# Altium schematic sheet ESP32-with-USB.SchDoc
size A2; SheetNumber: 1; SheetTotal: 1
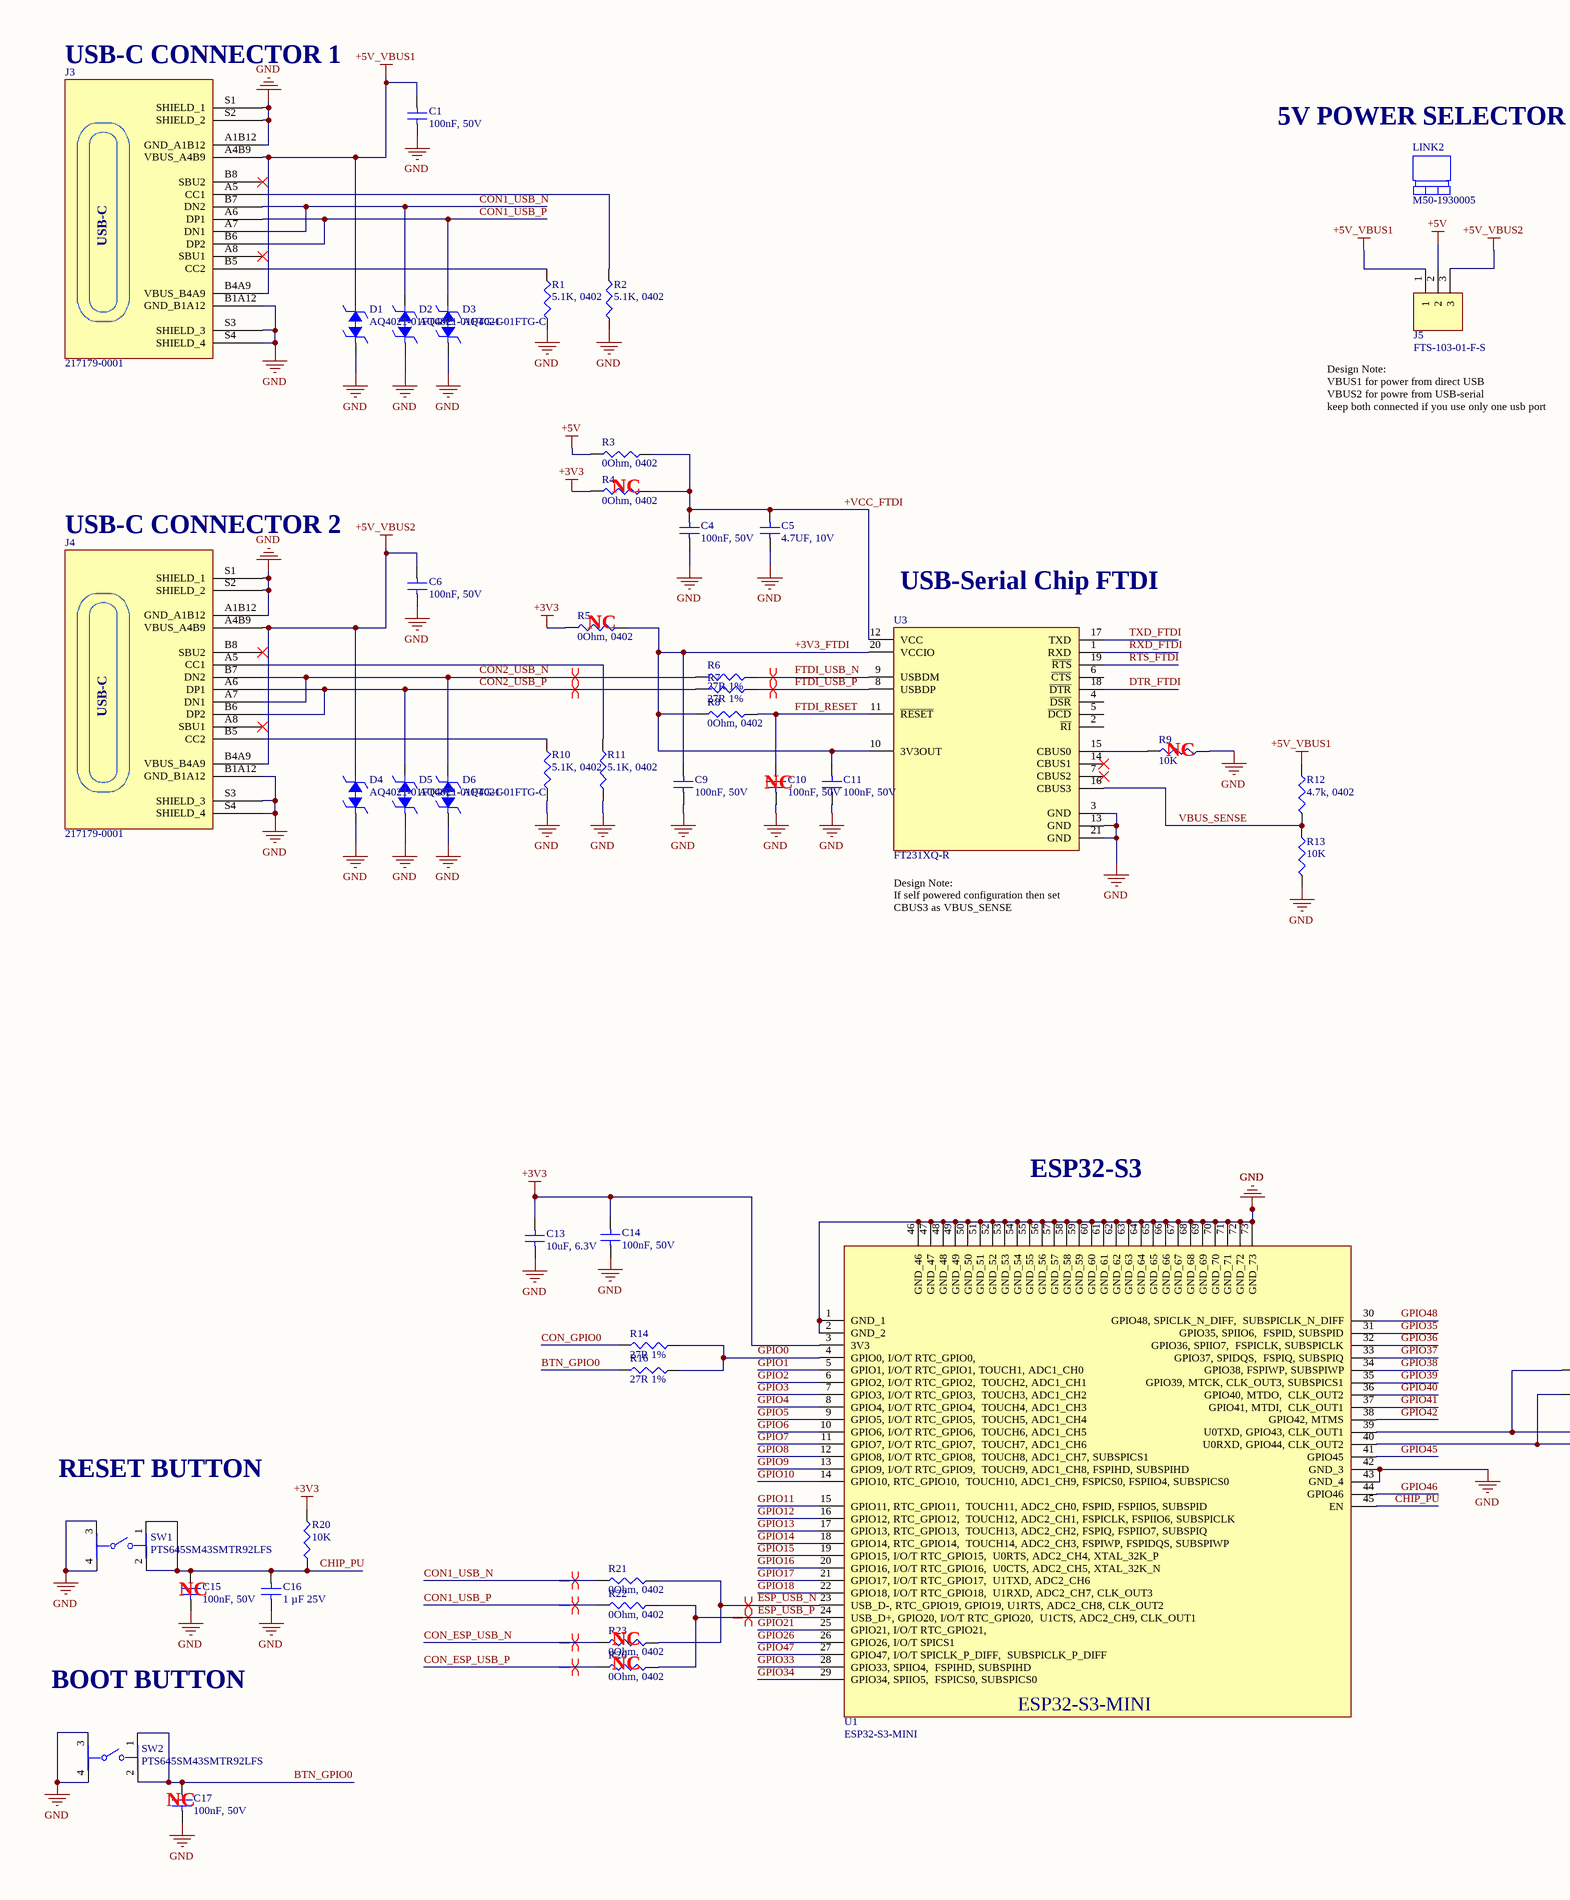
[diagram p0: ESP32-with-USB.SchDoc, left]
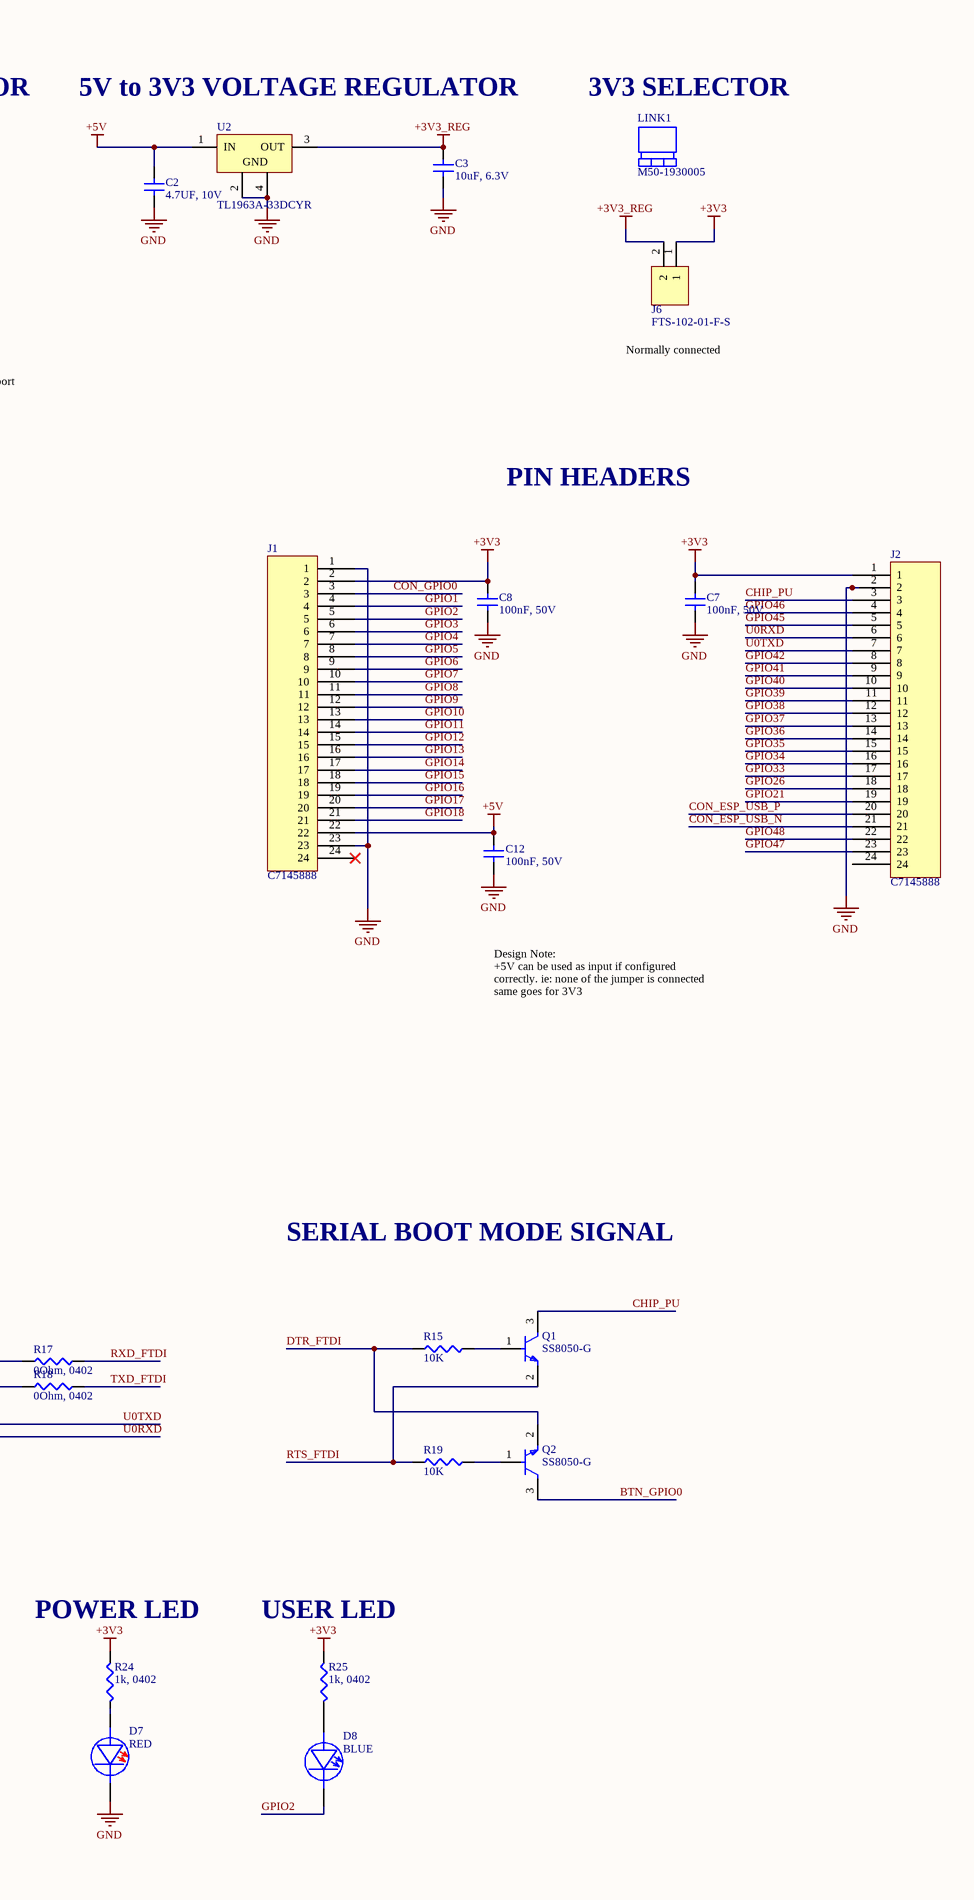
[diagram p1: ESP32-with-USB.SchDoc, right]

## Parts
C1  100nF, 50V  [CAPC1005X55N]
C2  4.7UF, 10V  [CAPC1005X55N]
C3  10uF, 6.3V  [CAPC1005X55N]
C4  100nF, 50V  [CAPC1005X55N]
C5  4.7UF, 10V  [CAPC1005X55N]
C6  100nF, 50V  [CAPC1005X55N]
C7  100nF, 50V  [CAPC1005X55N]
C8  100nF, 50V  [CAPC1005X55N]
C9  100nF, 50V  [CAPC1005X55N]
C10  100nF, 50V  [CAPC1005X55N]
C11  100nF, 50V  [CAPC1005X55N]
C12  100nF, 50V  [CAPC1005X55N]
C13  10uF, 6.3V  [CAPC1005X55N]
C14  100nF, 50V  [CAPC1005X55N]
C15  100nF, 50V  [CAPC1005X55N]
C16  1 µF 25V  [CAPC1005X55N]
C17  100nF, 50V  [CAPC1005X55N]
D1  AQ4021-01FTG-C  [AQ4021-01FTG-C_0805]
D2  AQ4021-01FTG-C  [AQ4021-01FTG-C_0805]
D3  AQ4021-01FTG-C  [AQ4021-01FTG-C_0805]
D4  AQ4021-01FTG-C  [AQ4021-01FTG-C_0805]
D5  AQ4021-01FTG-C  [AQ4021-01FTG-C_0805]
D6  AQ4021-01FTG-C  [AQ4021-01FTG-C_0805]
D7  RED  [LED_RED_0402]
D8  BLUE  [LED_BLUE_0402]
J1  C7145888  [HDR_1X24_2.54MM]
J2  C7145888  [HDR_1X24_2.54MM]
J3  217179-0001  [FP-2171790001-MFG]
J4  217179-0001  [FP-2171790001-MFG]
J5  FTS-103-01-F-S  [HDR_1X3_1.27MM]
J6  FTS-102-01-F-S  [HDR_1X2_1.27MM]
LINK1  M50-1930005  (mechanical)
LINK2  M50-1930005  (mechanical)
Q1  SS8050-G  [FP-SS8050-G-IPC_B]
Q2  SS8050-G  [FP-SS8050-G-IPC_B]
R1  5.1K, 0402  [RESC1005X37N]
R2  5.1K, 0402  [RESC1005X37N]
R3  0Ohm, 0402  [RESC1005X37N]
R4  0Ohm, 0402  [RESC1005X37N]
R5  0Ohm, 0402  [RESC1005X37N]
R6  27R 1%  [RESC1005X37N]
R7  27R 1%  [RESC1005X37N]
R8  0Ohm, 0402  [RESC1005X37N]
R9  10K  [RESC1005X37N]
R10  5.1K, 0402  [RESC1005X37N]
R11  5.1K, 0402  [RESC1005X37N]
R12  4.7k, 0402  [RESC1005X37N]
R13  10K  [RESC1005X37N]
R14  27R 1%  [RESC1005X37N]
R15  10K  [RESC1005X37N]
R16  27R 1%  [RESC1005X37N]
R17  0Ohm, 0402  [RESC1005X37N]
R18  0Ohm, 0402  [RESC1005X37N]
R19  10K  [RESC1005X37N]
R20  10K  [RESC1005X37N]
R21  0Ohm, 0402  [RESC1005X37N]
R22  0Ohm, 0402  [RESC1005X37N]
R23  0Ohm, 0402  [RESC1005X37N]
R24  1k, 0402  [RESC1005X37N]
R25  1k, 0402  [RESC1005X37N]
R26  0Ohm, 0402  [RESC1005X37N]
SW1  PTS645SM43SMTR92LFS  [FP-PTS645SM43SMTR92LFS-MFG]
SW2  PTS645SM43SMTR92LFS  [FP-PTS645SM43SMTR92LFS-MFG]
U1  ESP32-S3-MINI  [XCVR_ESP32-S3-MINI-1-N8]
U2  TL1963A-33DCYR  [DCY0004A_N]
U3  FT231XQ-R  [FP-QFN-20-IPC_B]

## Nets
+3V3: C7.2 C8.2 C13.2 C14.2 J1.2 J2.1 J6.1 R4.1 R5.1 R20.2 R24.1 R25.1 U1.3(3V3)
+3V3_REG: C3.2 J6.2 U2.3(OUT)
+5V: C2.2 C12.2 J1.22 J5.2 R3.1 U2.1(IN)
+5V_VBUS1: C1.2 D1.2 J3.A4B9(VBUS_A4B9) J3.B4A9(VBUS_B4A9) J5.1 R12.2
+5V_VBUS2: C6.2 D4.2 J4.A4B9(VBUS_A4B9) J4.B4A9(VBUS_B4A9) J5.3
GND: C1.1 C2.1 C3.1 C4.1 C5.1 C6.1 C7.1 C8.1 C9.1 C10.1 C11.1 C12.1 C13.1 C14.1 C15.1 C16.1 C17.1 D1.1 D2.1 D3.1 D4.1 D5.1 D6.1 D7.K- J1.1 J1.23 J2.2 J3.A1B12(GND_A1B12) J3.B1A12(GND_B1A12) J3.S1(SHIELD_1) J3.S2(SHIELD_2) J3.S3(SHIELD_3) J3.S4(SHIELD_4) J4.A1B12(GND_A1B12) J4.B1A12(GND_B1A12) J4.S1(SHIELD_1) J4.S2(SHIELD_2) J4.S3(SHIELD_3) J4.S4(SHIELD_4) R1.2 R2.2 R9.2 R10.2 R11.2 R13.1 SW1.3 SW1.4 SW2.3 SW2.4 U1.1(GND_1) U1.2(GND_2) U1.42(GND_3) U1.43(GND_4) U1.46(GND_46) U1.47(GND_47) U1.48(GND_48) U1.49(GND_49) U1.50(GND_50) U1.51(GND_51) U1.52(GND_52) U1.53(GND_53) U1.54(GND_54) U1.55(GND_55) U1.56(GND_56) U1.57(GND_57) U1.58(GND_58) U1.59(GND_59) U1.60(GND_60) U1.61(GND_61) U1.62(GND_62) U1.63(GND_63) U1.64(GND_64) U1.65(GND_65) U1.66(GND_66) U1.67(GND_67) U1.68(GND_68) U1.69(GND_69) U1.70(GND_70) U1.71(GND_71) U1.72(GND_72) U1.73(GND_73) U2.2(GND) U2.4(GND) U3.3(GND) U3.13(GND) U3.21(GND)
+3V3_FTDI: C9.2 C11.2 R5.2 R8.1 U3.10(3V3OUT) U3.20(VCCIO)
+VCC_FTDI: C4.2 C5.2 R3.2 R4.2 U3.12(VCC)
BTN_GPIO0: C17.2 Q2.3(C) R16.1 SW2.1 SW2.2
CHIP_PU: C15.2 C16.2 J2.3 Q1.3(C) R20.1 SW1.1 SW1.2 U1.45(EN)
CON1_USB_N: D2.2 J3.A7(DN1) J3.B7(DN2) R21.1
CON1_USB_P: D3.2 J3.A6(DP1) J3.B6(DP2) R22.1
CON2_USB_N: D6.2 J4.A7(DN1) J4.B7(DN2) R6.1
CON2_USB_P: D5.2 J4.A6(DP1) J4.B6(DP2) R7.1
CON_ESP_USB_N: J2.21 R23.1
CON_ESP_USB_P: J2.20 R26.1
CON_GPIO0: J1.3 R14.1
DTR_FTDI: Q2.2(E) R15.1 U3.18(~{DTR})
ESP_USB_N: R21.2 R23.2 U1.23(USB_D-,_RTC_GPIO19,_GPIO19,_U1RTS,_ADC2_CH8,_CLK_OUT2)
ESP_USB_P: R22.2 R26.2 U1.24(USB_D+,_GPIO20,_I/O/T_RTC_GPIO20,__U1CTS,_ADC2_CH9,_CLK_OUT1)
FTDI_RESET: C10.2 R8.2 U3.11(~{RESET})
FTDI_USB_N: R6.2 U3.9(USBDM)
FTDI_USB_P: R7.2 U3.8(USBDP)
GPIO0: R14.2 R16.2 U1.4(GPIO0,_I/O/T_RTC_GPIO0,)
GPIO1: J1.4 U1.5(GPIO1,_I/O/T_RTC_GPIO1,_TOUCH1,_ADC1_CH0)
GPIO2: D8.K- J1.5 U1.6(GPIO2,_I/O/T_RTC_GPIO2,__TOUCH2,_ADC1_CH1)
GPIO3: J1.6 U1.7(GPIO3,_I/O/T_RTC_GPIO3,__TOUCH3,_ADC1_CH2)
GPIO4: J1.7 U1.8(GPIO4,_I/O/T_RTC_GPIO4,__TOUCH4,_ADC1_CH3)
GPIO5: J1.8 U1.9(GPIO5,_I/O/T_RTC_GPIO5,__TOUCH5,_ADC1_CH4)
GPIO6: J1.9 U1.10(GPIO6,_I/O/T_RTC_GPIO6,__TOUCH6,_ADC1_CH5)
GPIO7: J1.10 U1.11(GPIO7,_I/O/T_RTC_GPIO7,__TOUCH7,_ADC1_CH6)
GPIO8: J1.11 U1.12(GPIO8,_I/O/T_RTC_GPIO8,__TOUCH8,_ADC1_CH7,_SUBSPICS1)
GPIO9: J1.12 U1.13(GPIO9,_I/O/T_RTC_GPIO9,__TOUCH9,_ADC1_CH8,_FSPIHD,_SUBSPIHD)
GPIO10: J1.13 U1.14(GPIO10,_RTC_GPIO10,__TOUCH10,_ADC1_CH9,_FSPICS0,_FSPIIO4,_SUBSPICS0)
GPIO11: J1.14 U1.15(GPIO11,_RTC_GPIO11,__TOUCH11,_ADC2_CH0,_FSPID,_FSPIIO5,_SUBSPID)
GPIO12: J1.15 U1.16(GPIO12,_RTC_GPIO12,__TOUCH12,_ADC2_CH1,_FSPICLK,_FSPIIO6,_SUBSPICLK)
GPIO13: J1.16 U1.17(GPIO13,_RTC_GPIO13,__TOUCH13,_ADC2_CH2,_FSPIQ,_FSPIIO7,_SUBSPIQ)
GPIO14: J1.17 U1.18(GPIO14,_RTC_GPIO14,__TOUCH14,_ADC2_CH3,_FSPIWP,_FSPIDQS,_SUBSPIWP)
GPIO15: J1.18 U1.19(GPIO15,_I/O/T_RTC_GPIO15,__U0RTS,_ADC2_CH4,_XTAL_32K_P)
GPIO16: J1.19 U1.20(GPIO16,_I/O/T_RTC_GPIO16,__U0CTS,_ADC2_CH5,_XTAL_32K_N)
GPIO17: J1.20 U1.21(GPIO17,_I/O/T_RTC_GPIO17,__U1TXD,_ADC2_CH6)
GPIO18: J1.21 U1.22(GPIO18,_I/O/T_RTC_GPIO18,__U1RXD,_ADC2_CH7,_CLK_OUT3)
GPIO21: J2.19 U1.25(GPIO21,_I/O/T_RTC_GPIO21,)
GPIO26: J2.18 U1.26(GPIO26,_I/O/T_SPICS1)
GPIO33: J2.17 U1.28(GPIO33,_SPIIO4,__FSPIHD,_SUBSPIHD)
GPIO34: J2.16 U1.29(GPIO34,_SPIIO5,__FSPICS0,_SUBSPICS0)
GPIO35: J2.15 U1.31(GPIO35,_SPIIO6,__FSPID,_SUBSPID)
GPIO36: J2.14 U1.32(GPIO36,_SPIIO7,__FSPICLK,_SUBSPICLK)
GPIO37: J2.13 U1.33(GPIO37,_SPIDQS,__FSPIQ,_SUBSPIQ)
GPIO38: J2.12 U1.34(GPIO38,_FSPIWP,_SUBSPIWP)
GPIO39: J2.11 U1.35(GPIO39,_MTCK,_CLK_OUT3,_SUBSPICS1)
GPIO40: J2.10 U1.36(GPIO40,_MTDO,__CLK_OUT2)
GPIO41: J2.9 U1.37(GPIO41,_MTDI,__CLK_OUT1)
GPIO42: J2.8 U1.38(GPIO42,_MTMS)
GPIO45: J2.5 U1.41(GPIO45)
GPIO46: J2.4 U1.44(GPIO46)
GPIO47: J2.23 U1.27(GPIO47,_I/O/T_SPICLK_P_DIFF,__SUBSPICLK_P_DIFF)
GPIO48: J2.22 U1.30(GPIO48,_SPICLK_N_DIFF,__SUBSPICLK_N_DIFF)
RTS_FTDI: Q1.2(E) R19.1 U3.19(~{RTS})
RXD_FTDI: R17.2 U3.1(RXD)
TXD_FTDI: R18.2 U3.17(TXD)
U0RXD: J2.6 R18.1 U1.40(U0RXD,_GPIO44,_CLK_OUT2)
U0TXD: J2.7 R17.1 U1.39(U0TXD,_GPIO43,_CLK_OUT1)
VBUS_SENSE: R12.1 R13.2 U3.16(CBUS3)
NetD7_A+: D7.A+ R24.2
NetD8_A+: D8.A+ R25.2
NetJ3_A5: J3.A5(CC1) R2.1
NetJ3_B5: J3.B5(CC2) R1.1
NetJ4_A5: J4.A5(CC1) R11.1
NetJ4_B5: J4.B5(CC2) R10.1
NetQ1_1: Q1.1(B) R15.2
NetQ2_1: Q2.1(B) R19.2
NetR9_1: R9.1 U3.15(CBUS0)

Not connected (* = marked no-connect by the designer): J1 24*; J2 24; J3 A8(SBU1)* B8(SBU2)*; J4 A8(SBU1)* B8(SBU2)*; U3 2(~{RI}) 4(~{DSR}) 5(~{DCD}) 6(~{CTS}) 7(CBUS2)* 14(CBUS1)*

## Layout directives
differential pair; differential pair class DIFF90: CON1_USB_N, CON1_USB_P, CON2_USB_N, CON2_USB_P, CON_ESP_USB_N, CON_ESP_USB_P, ESP_USB_N, ESP_USB_P, FTDI_USB_N, FTDI_USB_P

## Notes on the sheet
- (near J3) USB-C CONNECTOR 1
- 5V POWER SELECTOR
- 5V to 3V3 VOLTAGE REGULATOR
- 3V3 SELECTOR
- Design Note:
  VBUS1 for power from direct USB
  VBUS2 for powre from USB-serial
  keep both connected if you use only one usb port
- Normally connected
- (near J4) USB-C CONNECTOR 2
- (near R4) NC
- PIN HEADERS
- (near U3) USB-Serial Chip FTDI
- (near R5) NC
- (near R9) NC
- (near C10) NC
- (near U3) Design Note:
  If self powered configuration then set CBUS3 as VBUS_SENSE
- Design Note:
  +5V can be used as input if configured correctly. ie: none of the jumper is connected
  same goes for 3V3
- ESP32-S3
- SERIAL BOOT MODE SIGNAL
- RESET BUTTON
- (near C15) NC
- (near R23) NC
- (near R24) POWER LED
- (near R25) USER LED
- BOOT BUTTON
- (near R26) NC
- (near C17) NC
- (in symbol 217179-0001) USB-C

## Library data of the parts
C1 C4 C6-C12 C14 C15 C17 = CL05B104KB54PNC: 0.1 µF ±10% 50V Ceramic Capacitor X7R 0402 (1005 Metric); Manufacturer: Samsung; Material: 4241ConductorMaterial; Supplier: Arrow Electronics; Supplier Part Number: CL05B104KB54PNC; Manufacturer Part Number: CL05B104KB54PNC; RoHS: Yes; Category: Ceramic Capacitors; Stock: 2120000; Pricing: 10000=0.0057 (USD); Case/Package: 343Case; Min Operating Temperature: -55°C; Max Operating Temperature: 125°C; Tolerance: 10%; Voltage Rating: 50V; Value: 100nF; Height: 550um; RoHS Compliant: Yes; ComponentLink1URL: https://datasheet.octopart.com/CL05B104KB54PNC-Samsung-datasheet-8326407.pdf?src-supplier=TME; ComponentLink1Description: https://datasheet.octopart.com/CL05B104KB54PNC-Samsung-datasheet-8326407.pdf?src-supplier=TME; LCSC Part Number: C307331
C2 C5 = CL05A475MP5NRNC: CAP CER 4.7UF 10V X5R 0402; Manufacturer: Samsung; Dielectric Material: Ceramic; Multilayer: Yes; Tolerance  (fill in as +-): 20%; Supplier: Digikey; Supplier Part Number: 1276-1482-1-ND; Manufacturer Part Number: CL05A475MP5NRNC; RoHS: Yes; Category: Ceramic Capacitors; Stock: 2427092; Pricing: 1=0.1, 10=0.064, 50=0.0368, 100=0.0286, 500=0.0215, 1000=0.01689, 2500=0.01535, 5000=0.01412 (USD); Mounting Technology: Surface Mount; Pins: 2; Package Shape: Rectangular; Case/Package: 0402; Terminal Finish: Nickel; Min Operating Temperature: -55°C; Max Operating Temperature: 85°C; JESD-609 Code: e3; Value: 4.7uF; Capacitor Type: Ceramic; Package Style: SMTMeter; Packaging: Tape and Reel; Tolerance (fill in as +-): 20%; Rated DC Voltage (URdc): 10V; Temperature Characteristics Code: X5R; Termination: Wraparound; Length: 1mm; Width: 0.5mm; Height: 0.65mm; Reach SVHC Compliant: Yes; RoHS Compliant: Yes; ComponentLink1URL: https://datasheet.ciiva.com:443/pdfs/VipMasterIC/IC/SEMS/SEMS-S-A0009022611/SEMS-S-A0009022611-1.pdf?src-supplier=IHS+Markit; ComponentLink1Description: https://datasheet.ciiva.com:443/pdfs/VipMasterIC/IC/SEMS/SEMS-S-A0009022611/SEMS-S-A0009022611-1.pdf?src-supplier=IHS+Markit; ComponentLink2URL: https://datasheet.ciiva.com/25786/cl05a475mp5nrnc-25786963.pdf?src-supplier=Digikey; ComponentLink2Description: https://datasheet.ciiva.com/25786/cl05a475mp5nrnc-25786963.pdf?src-supplier=Digikey; ComponentLink3URL: https://datasheet.ciiva.com/16437/cl05b104kq5nnnc-16437353.pdf?src-supplier=Future+Electronics; ComponentLink3Description: https://datasheet.ciiva.com/16437/cl05b104kq5nnnc-16437353.pdf?src-supplier=Future+Electronics; LCSC Part Number: C23733
C3 C13 = GRM155R60J106ME05D: 10 µF ±20% 6.3V Ceramic Capacitor X5R 0402 (1005 Metric); Manufacturer: Murata; Material: 4241ConductorMaterial; Dielectric: 1537DielectricType; Supplier: Future Electronics; Supplier Part Number: 5135029; Manufacturer Part Number: GRM155R60J106ME05D; RoHS: Yes; Category: Ceramic Capacitors; Stock: 20000; Pricing: 10000=0.0104, 30000=0.0099, 50000=0.0097, 100000=0.0095, 200000=0.0091 (USD); Case/Package: 343Case; Min Operating Temperature: -55°C; Max Operating Temperature: 85°C; Value: 10uF; Tolerance: 20%; Voltage Rating: 6.3V; Voltage Rating (DC): 6.3V; Length: 1mm; Width: 500um; Height: 700um; Thickness: 500um; ComponentLink1URL: https://datasheet.octopart.com/GRM155R60J106ME05D-Murata-datasheet-155239051.pdf?src-supplier=Element14; ComponentLink1Description: https://datasheet.octopart.com/GRM155R60J106ME05D-Murata-datasheet-155239051.pdf?src-supplier=Element14; ComponentLink2URL: https://datasheet.octopart.com/GRM155R60J106ME05D-Murata-datasheet-165579666.pdf?src-supplier=TME; ComponentLink2Description: https://datasheet.octopart.com/GRM155R60J106ME05D-Murata-datasheet-165579666.pdf?src-supplier=TME; LCSC Part Number: C723895
C16 = CL05A105KA5NQNC: 1 µF ±10% 25V Ceramic Capacitor X5R 0402 (1005 Metric); Manufacturer: Samsung; Value: 1uF; Multilayer: Yes; Supplier: Digikey; Supplier Part Number: 1276-1445-1-ND; Manufacturer Part Number: CL05A105KA5NQNC; RoHS: Yes; Category: Ceramic Capacitors; Stock: 1937229; Pricing: 1=0.18, 10=0.124, 50=0.0742, 100=0.0584, 500=0.04312, 1000=0.0357, 2500=0.03323, 5000=0.0304 (USD); Mounting Technology: Surface Mount; Pins: 2; Case/Package: 0402; Terminal Finish: Nickel; Dielectric Material: Ceramic; Package Shape: Rectangular; Min Operating Temperature: -55°C; Max Operating Temperature: 85°C; JESD-609 Code: e3; Package Style: SMTMeter; Packaging: Tape and Reel; Termination: Wraparound; Capacitor Type: Ceramic; Tolerance  (fill in as +-): 10%; Tolerance (fill in as +-): 10%; Rated DC Voltage (URdc): 25V; Temperature Characteristics Code: X5R; Length: 1mm; Width: 0.5mm; Height: 0.6mm; Reach SVHC Compliant: Yes; RoHS Compliant: Yes; ComponentLink1URL: https://datasheet.ciiva.com:443/pdfs/VipMasterIC/IC/SEMS/SEMS-S-A0008384515/SEMS-S-A0008872946-1.pdf?src-supplier=IHS+Markit; ComponentLink1Description: https://datasheet.ciiva.com:443/pdfs/VipMasterIC/IC/SEMS/SEMS-S-A0008384515/SEMS-S-A0008872946-1.pdf?src-supplier=IHS+Markit; ComponentLink2URL: https://datasheet.ciiva.com/25720/cl05a105ka5nqnc-25720771.pdf?src-supplier=Digikey; ComponentLink2Description: https://datasheet.ciiva.com/25720/cl05a105ka5nqnc-25720771.pdf?src-supplier=Digikey; ComponentLink3URL: https://datasheet.ciiva.com/3777/cl05a105ka5nqnc-3777709.pdf?src-supplier=Arrow+Electronics; ComponentLink3Description: https://datasheet.ciiva.com/3777/cl05a105ka5nqnc-3777709.pdf?src-supplier=Arrow+Electronics; ComponentLink4URL: https://datasheet.ciiva.com/29198/459147-da-01-en-vs-kondensator-0402-29198339.pdf?src-supplier=Conrad; ComponentLink4Description: https://datasheet.ciiva.com/29198/459147-da-01-en-vs-kondensator-0402-29198339.pdf?src-supplier=Conrad; LCSC Part Number: C52923
D1-D6 = AQ4021-01FTG-C: Trans Voltage Suppressor Diode; Manufacturer: Littelfuse; Time @ Peak Reflow Temperature-Max (s): 40s; Supplier: Digikey; Supplier Part Number: F10397CT-ND; Manufacturer Part Number: AQ4021-01FTG-C; RoHS: Yes; Category: TVS Diodes; Stock: 6289; Pricing: 1=0.57, 10=0.498, 100=0.3447, 500=0.28802, 1000=0.24513 (USD); Terminal Finish: Tin; JESD-609 Code: e3; Diode Type: TRANS VOLTAGE SUPPRESSOR; Moisture Sensitivity Level: 1; Peak Reflow Temperature (Cel): 260°C; Reach SVHC Compliant: Yes; RoHS Compliant: Yes; ComponentLink1URL: https://datasheet.ciiva.com:443/pdfs/VipMasterIC/IC/LFSI/LFSI-S-A0009000937/LFSI-S-A0009000937-1.pdf?src-supplier=IHS+Markit; ComponentLink1Description: https://datasheet.ciiva.com:443/pdfs/VipMasterIC/IC/LFSI/LFSI-S-A0009000937/LFSI-S-A0009000937-1.pdf?src-supplier=IHS+Markit; ComponentLink2URL: http://www.farnell.com/datasheets/2571805.pdf?src-supplier=Farnell; ComponentLink2Description: http://www.farnell.com/datasheets/2571805.pdf?src-supplier=Farnell; ComponentLink3URL: http://www.farnell.com/datasheets/2571805.pdf?src-supplier=Newark; ComponentLink3Description: http://www.farnell.com/datasheets/2571805.pdf?src-supplier=Newark; ComponentLink4URL: http://www.littelfuse.com/~/media/electronics/datasheets/tvs_diode_arrays/littelfuse_tvs_diode_array_aq4021_datasheet.pdf.pdf?src-supplier=Digikey; ComponentLink4Description: http://www.littelfuse.com/~/media/electronics/datasheets/tvs_diode_arrays/littelfuse_tvs_diode_array_aq4021_datasheet.pdf.pdf?src-supplier=Digikey; ComponentLink5URL: https://www.littelfuse.com/~/media/electronics/datasheets/tvs_diode_arrays/littelfuse_tvs_diode_array_aq4021_datasheet.pdf.pdf?src-supplier=Digikey; ComponentLink5Description: https://www.littelfuse.com/~/media/electronics/datasheets/tvs_diode_arrays/littelfuse_tvs_diode_array_aq4021_datasheet.pdf.pdf?src-supplier=Digikey; LCSC Part Number: C708873
D7 = VLMS1500-GS08: LED RED 0402 SMD; Manufacturer: Vishay; Viewing Angle: 130°; Forward Current: 30mA; Forward Voltage: 2V; Luminous Intensity: 54mcd; Dominant Wavelength: 631nm; Test Current: 20mA; Lens Style: Flat,Rectangular,Square; Number of LEDs: 1; Power Rating: 75mW; Lens Size: 0.5mm; Supplier: Digikey; Supplier Part Number: VLMS1500-GS08CT-ND; Manufacturer Part Number: VLMS1500-GS08; RoHS: Yes; Category: LEDs; Stock: 52203; Pricing: 1=0.34, 10=0.265, 100=0.119, 500=0.10746, 1000=0.08827 (USD); Mounting Technology: Surface Mount; Case/Package: 0402; Pins: 2; Color: Red; Case Code (Metric): 1005; Case Code (Imperial): 0402; Min Operating Temperature: -30°C; Max Operating Temperature: 85°C; Package Quantity: 9000; Packaging: Tape and Reel; Illumination Color: Red; Wavelength: 631nm; Series: CHipLED; Length: 1mm; Width: 0.5mm; Height: 0.55mm; Radiation Hardening: No; Lead Free: Lead Free; RoHS Compliant: Yes; Reach SVHC Compliant: Unknown; ComponentLink1URL: http://components.arrow.com/part/dataview/56357384S461524N5680?src-supplier=Arrow+Electronics; ComponentLink1Description: http://components.arrow.com/part/dataview/56357384S461524N5680?src-supplier=Arrow+Electronics; ComponentLink2URL: http://www.mouser.com/ds/2/427/vlmo1500-244705.pdf?src-supplier=Mouser; ComponentLink2Description: http://www.mouser.com/ds/2/427/vlmo1500-244705.pdf?src-supplier=Mouser; ComponentLink3URL: http://www.farnell.com/datasheets/1809983.pdf?src-supplier=Farnell; ComponentLink3Description: http://www.farnell.com/datasheets/1809983.pdf?src-supplier=Farnell; ComponentLink4URL: http://www.alliedelec.com/m/d/cfc385e1097fc985ee9a50a3551ac188.pdf?src-supplier=Allied+Electronics; ComponentLink4Description: http://www.alliedelec.com/m/d/cfc385e1097fc985ee9a50a3551ac188.pdf?src-supplier=Allied+Electronics; ComponentLink5URL: https://datasheet.octopart.com/VLMS1500-GS08-Vishay-datasheet-62332426.pdf?src-supplier=Newark; ComponentLink5Description: https://datasheet.octopart.com/VLMS1500-GS08-Vishay-datasheet-62332426.pdf?src-supplier=Newark; ComponentLink6URL: http://www.vishay.com/docs/82554/vlmo1500.pdf?src-supplier=Avnet; ComponentLink6Description: http://www.vishay.com/docs/82554/vlmo1500.pdf?src-supplier=Avnet; ComponentLink7URL: https://datasheet.octopart.com/VLMS1500-GS08-Vishay-datasheet-21227148.pdf?src-supplier=Future+Electronics; ComponentLink7Description: https://datasheet.octopart.com/VLMS1500-GS08-Vishay-datasheet-21227148.pdf?src-supplier=Future+Electronics; ComponentLink8URL: http://www.farnell.com/datasheets/2050839.pdf?src-supplier=Newark; ComponentLink8Description: http://www.farnell.com/datasheets/2050839.pdf?src-supplier=Newark; ComponentLink9URL: http://www.farnell.com/datasheets/1809983.pdf?src-supplier=Element14; ComponentLink9Description: http://www.farnell.com/datasheets/1809983.pdf?src-supplier=Element14; ComponentLink10URL: https://datasheet.octopart.com/VLMS1500-GS08-Vishay-datasheet-33014519.pdf?src-supplier=Element14; ComponentLink10Description: https://datasheet.octopart.com/VLMS1500-GS08-Vishay-datasheet-33014519.pdf?src-supplier=Element14; ComponentLink11URL: http://www.farnell.com/datasheets/1809983.pdf?src-supplier=Newark; ComponentLink11Description: http://www.farnell.com/datasheets/1809983.pdf?src-supplier=Newark; ComponentLink12URL: http://datasheet.octopart.com/VLMS1500-GS08-Vishay-datasheet-21227148.pdf?src-supplier=Avnet; ComponentLink12Description: http://datasheet.octopart.com/VLMS1500-GS08-Vishay-datasheet-21227148.pdf?src-supplier=Avnet; ComponentLink13URL: http://datasheet.octopart.com/VLMS1500-GS08-Vishay-datasheet-21227148.pdf?src-supplier=LCSC; ComponentLink13Description: http://datasheet.octopart.com/VLMS1500-GS08-Vishay-datasheet-21227148.pdf?src-supplier=LCSC; ComponentLink14URL: http://datasheet.octopart.com/VLMS1500-GS08-Vishay-datasheet-21227148.pdf?src-supplier=Quest; ComponentLink14Description: http://datasheet.octopart.com/VLMS1500-GS08-Vishay-datasheet-21227148.pdf?src-supplier=Quest; ComponentLink15URL: http://datasheet.octopart.com/VLMS1500-GS08-Vishay-datasheet-21227148.pdf?src-supplier=NAC+Semi; ComponentLink15Description: http://datasheet.octopart.com/VLMS1500-GS08-Vishay-datasheet-21227148.pdf?src-supplier=NAC+Semi; LCSC Part Number: C511370
D8 = VLMB1500-GS08: LED BLUE 0402 SMD 468nm; Manufacturer: Vishay; Supplier: Digikey; Supplier Part Number: VLMB1500-GS08CT-ND; Manufacturer Part Number: VLMB1500-GS08; RoHS: Yes; Category: LEDs; Stock: 74699; Pricing: 1=0.39, 10=0.307, 100=0.1378, 500=0.12444, 1000=0.10221 (USD); ComponentLink1URL: https://datasheet.ciiva.com/30005/vlmo1500-30005132.pdf?src-supplier=Avnet; ComponentLink1Description: https://datasheet.ciiva.com/30005/vlmo1500-30005132.pdf?src-supplier=Avnet; LCSC Part Number: C511042
J1 J2 = 0022284245: CONN HEADER VERT 24POS 2.54MM; Manufacturer: Molex; Connector Type: BOARD CONNECTOR; Option: General Purpose; Filter Feature: No; Mating Information: MULTIPLE MATING PARTS AVAILABLE; Number of Rows Loaded: 1; Number of Contacts: 24; Supplier: Digikey; Supplier Part Number: 900-0022284245-ND; Manufacturer Part Number: 0022284245; RoHS: Yes; Category: Uncategorized; Stock: 2996; Pricing: 1=0.95, 10=0.789, 100=0.6579, 1000=0.57911 (USD); Mounting Technology: Board; Contact Material: Brass; Contact Finish - Mating: GOLD; Contact Finish - Termination: Tin (Sn); JESD-609 Code: e3; Contact Gender: Male; Mixed Contacts: No; Mounting Style: STRAIGHT; Termination: Solder; Terminal Pitch: 2.54mm; Flammability Rating: UL94 V-0; DIN Conformance: No; IEC Conformance: No; MIL Conformance: No; Reach SVHC Compliant: Yes; RoHS Compliant: Yes; ComponentLink1URL: https://datasheet.ciiva.com:443/pdfs/VipMasterIC/IC/MOLE/MOLE-S-A0006764423/MOLE-S-A0006877704-1.pdf?src-supplier=IHS+Markit; ComponentLink1Description: https://datasheet.ciiva.com:443/pdfs/VipMasterIC/IC/MOLE/MOLE-S-A0006764423/MOLE-S-A0006877704-1.pdf?src-supplier=IHS+Markit; ComponentLink2URL: https://datasheet.ciiva.com/6814/022284363-sd-6814049.pdf?src-supplier=Digikey; ComponentLink2Description: https://datasheet.ciiva.com/6814/022284363-sd-6814049.pdf?src-supplier=Digikey; ComponentLink3URL: https://datasheet.ciiva.com/10075/0022284245-pcb-headers-10075617.pdf?src-supplier=Avnet; ComponentLink3Description: https://datasheet.ciiva.com/10075/0022284245-pcb-headers-10075617.pdf?src-supplier=Avnet; ComponentLink4URL: https://datasheet.ciiva.com/5153/0022284245-pcb-headers-228340-5153875.pdf?src-supplier=Mouser; ComponentLink4Description: https://datasheet.ciiva.com/5153/0022284245-pcb-headers-228340-5153875.pdf?src-supplier=Mouser; ComponentLink5URL: https://datasheet.ciiva.com/1433/1597854-1433759.pdf?src-supplier=Element14; ComponentLink5Description: https://datasheet.ciiva.com/1433/1597854-1433759.pdf?src-supplier=Element14; LCSC Part Number: C7145888
J3 J4 = 217179-0001: USB Type C - Connector, Top-mount SMT, 16pos | Molex Incorporated 217179-0001; Supplier: Digikey; Supplier Part Number: 900-2171790001CT-ND; Manufacturer: Molex; Manufacturer Part Number: 217179-0001; RoHS: No; Category: Connectors; Pricing: 1=0.9, 10=0.745, 100=0.6212 (USD); LCSC Part Number: C3197684
J5 = FTS-103-01-F-S: CONN HEADER VERT 3POS 1.27MM; Manufacturer: Samtec; Manufacturer Series: FTS; Connector Type: BOARD CONNECTOR; Option: General Purpose; Additional Feature: Low Profile; Filter Feature: No; Number of Rows Loaded: 1; Number of Contacts: 3; Supplier: Digikey; Supplier Part Number: 612-FTS-103-01-F-S-ND; Manufacturer Part Number: FTS-103-01-F-S; RoHS: Yes; Category: Connectors; Stock: 3030; Pricing: 1=0.73, 50=0.6378, 100=0.5407, 500=0.4491, 1000=0.4 (USD); Mounting Technology: Board; Contact Material: Bronze; Contact Finish - Mating: GOLD (3) OVER NICKEL (50); Contact Finish - Termination: Matte Tin (Sn) - with Nickel (Ni) barrier; JESD-609 Code: e3; Contact Gender: Male; Mixed Contacts: No; Mounting Style: STRAIGHT; Termination: Solder; Terminal Pitch: 1.27mm; Flammability Rating: UL94 V-0; DIN Conformance: No; IEC Conformance: No; MIL Conformance: No; Reach SVHC Compliant: Yes; RoHS Compliant: Yes; ComponentLink1URL: https://datasheet.ciiva.com:443/pdfs/VipMasterIC/IC/SAMI/SAMI-S-A0001504673/SAMI-S-A0001504673-1.pdf?src-supplier=IHS+Markit; ComponentLink1Description: https://datasheet.ciiva.com:443/pdfs/VipMasterIC/IC/SAMI/SAMI-S-A0001504673/SAMI-S-A0001504673-1.pdf?src-supplier=IHS+Markit; ComponentLink2URL: http://suddendocs.samtec.com/prints/fts-1xx-xx-xx-xx-xx-mkt.pdf?src-supplier=Digikey; ComponentLink2Description: http://suddendocs.samtec.com/prints/fts-1xx-xx-xx-xx-xx-mkt.pdf?src-supplier=Digikey; ComponentLink3URL: http://www.samtec.com/documents/webfiles/pdf/FTS.pdf?src-supplier=Avnet; ComponentLink3Description: http://www.samtec.com/documents/webfiles/pdf/FTS.pdf?src-supplier=Avnet; ComponentLink4URL: https://datasheet.octopart.com/FTS-103-01-F-S-Samtec-datasheet-116535195.pdf?src-supplier=Toby+Electronics; ComponentLink4Description: https://datasheet.octopart.com/FTS-103-01-F-S-Samtec-datasheet-116535195.pdf?src-supplier=Toby+Electronics; ComponentLink5URL: https://datasheet.octopart.com/FTS-103-01-F-S-Samtec-datasheet-151470456.pdf?src-supplier=Sager+Electronics; ComponentLink5Description: https://datasheet.octopart.com/FTS-103-01-F-S-Samtec-datasheet-151470456.pdf?src-supplier=Sager+Electronics; LCSC Part Number: C3333578
J6 = FTS-102-01-F-S: CONN HEADER VERT 2POS 1.27MM; Manufacturer: Samtec; Number of Contacts: 2; Gender: Male; Supplier: Digikey; Supplier Part Number: SAM15176-ND; Manufacturer Part Number: FTS-102-01-F-S; RoHS: Yes; Category: Connectors; Stock: 848; Pricing: 1=0.49, 50=0.4252, 100=0.3608, 500=0.2994, 1000=0.2625 (USD); Mounting Technology: Through Hole; Contact Plating: Gold; Contact Material: Bronze; Contact Shape: Square; Contact Finish - Mating: GOLD; Insulation Material: Polymer; Insulation Color: Black; Min Operating Temperature: -55°C; Max Operating Temperature: 125°C; Number of Rows: 1; Packaging: Bulk; Termination: Solder; Fastening Type: Pull; Series: FTS; Contact Type: Male Pin; Number of Positions: 2; Pitch: 1.27mm; Radiation Hardening: No; RoHS Compliant: Yes; Flammability Rating: UL94 V-0; ComponentLink1URL: http://www.samtec.com/documents/webfiles/pdf/FTS.pdf?src-supplier=Avnet; ComponentLink1Description: http://www.samtec.com/documents/webfiles/pdf/FTS.pdf?src-supplier=Avnet; LCSC Part Number: C6045317
LINK1 LINK2 = M50-1930005: CONN SHUNT 1.27MM BLUE; Manufacturer: Harwin; Manufacturer Series: M50; Connector Type: Interconnection Device; Body/Shell Style: PLUG; Contact Pattern: RECTANGULAR; Contact Resistance: 20mR; Durability: 300Cycles; Insulation Resistance: 1GR; Number Of Connectors: 1; Rated Current (Signal): 1A; Number of Contacts: 2; Dielectric Withstanding Voltage (AC): 500V; Body Breadth: 0.059inch; Body Length: 0.098inch; Mating Contact Pitch: 0.05inch; Body Depth: 0.118inch; Reference Standard: UL; Reliability: COMMERCIAL; Supplier: Digikey; Supplier Part Number: 952-1728-ND; Manufacturer Part Number: M50-1930005; RoHS: Yes; Category: Headers and Wire Housings; Stock: 11279; Pricing: 1=0.43, 10=0.363, 25=0.3196, 50=0.2936, 100=0.2821, 250=0.25332, 500=0.2418, 1000=0.2015, 3000=0.18422 (USD); Contact Finish - Mating: AU ON NI; Insulation Color: Blue; Insulation Material: Nylon; Contact Material: Copper Alloy; Min Operating Temperature: -40°C; Max Operating Temperature: 105°C; Contact Gender: Female; Mounting Style: STRAIGHT; Number of Rows Loaded: 1; Reach SVHC Compliant: Yes; RoHS Compliant: Yes; ComponentLink1URL: https://datasheet.ciiva.com:443/pdfs/VipMasterIC/IC/HRWN/HRWNS04645/HRWNS04645-1.pdf?src-supplier=IHS+Markit; ComponentLink1Description: https://datasheet.ciiva.com:443/pdfs/VipMasterIC/IC/HRWN/HRWNS04645/HRWNS04645-1.pdf?src-supplier=IHS+Markit; ComponentLink2URL: https://datasheet.ciiva.com/767/m50-19x-767920.pdf?src-supplier=Digikey; ComponentLink2Description: https://datasheet.ciiva.com/767/m50-19x-767920.pdf?src-supplier=Digikey; ComponentLink3URL: https://datasheet.ciiva.com/1412/1836978-1412126.pdf?src-supplier=Element14; ComponentLink3Description: https://datasheet.ciiva.com/1412/1836978-1412126.pdf?src-supplier=Element14; ComponentLink4URL: https://datasheet.ciiva.com/1456/m50-19x-1456641.pdf?src-supplier=Newark; ComponentLink4Description: https://datasheet.ciiva.com/1456/m50-19x-1456641.pdf?src-supplier=Newark; LCSC Part Number: C6586863
Q1 Q2 = SS8050-G: TRANS NPN 25V 1.5A SOT23-3; Manufacturer: Comchip; Supplier: Digikey; Supplier Part Number: 641-1790-1-ND; Manufacturer Part Number: SS8050-G; RoHS: Yes; Category: Transistors; Stock: 90458; Pricing: 1=0.29, 10=0.2, 100=0.0978, 500=0.08154, 1000=0.05666 (USD); Reach SVHC Compliant: Yes; RoHS Compliant: Yes; ComponentLink1URL: https://datasheet.ciiva.com:443/pdfs/VipMasterIC/IC/COMC/COMC-S-A0004994192/COMC-S-A0004994192-1.pdf?src-supplier=IHS+Markit; ComponentLink1Description: https://datasheet.ciiva.com:443/pdfs/VipMasterIC/IC/COMC/COMC-S-A0004994192/COMC-S-A0004994192-1.pdf?src-supplier=IHS+Markit; ComponentLink2URL: http://www.comchiptech.com/admin/files/product/SS8050-G RevA181526.pdf?src-supplier=Digikey; ComponentLink2Description: http://www.comchiptech.com/admin/files/product/SS8050-G RevA181526.pdf?src-supplier=Digikey; LCSC Part Number: C164886
R1 R2 R10 R11 = RC0402FR-075K1L: 5.1kOhm 1% 1/16W 0402; Manufacturer: Yageo; Additional Feature: LASER TRIMMABLE; Power: 62.5mW; Rated Temperature: 70°C; Value: 5.1kR; Temperature Coefficient: 100ppm/°C; Working Voltage: 50V; Package Height: 0.35mm; Package Length: 1mm; Package Width: 0.5mm; Supplier: Digikey; Supplier Part Number: 311-5.10KLRCT-ND; Manufacturer Part Number: RC0402FR-075K1L; RoHS: Yes; Category: Chip SMD Resistors; Stock: 360279; Pricing: 1=0.1, 10=0.015, 50=0.0088, 100=0.0073, 500=0.00488, 1000=0.00417, 5000=0.00297 (USD); Mounting Technology: Surface Mount; Pins: 2; Package Shape: Rectangular; Case/Package: 0402; Terminal Finish: Nickel; Min Operating Temperature: -55°C; Max Operating Temperature: 155°C; Tolerance: 1%; JESD-609 Code: e3; Resistor Type: FIXED RESISTOR; Construction: Chip; Package Style: SMTMeter; Packaging: Tape and Reel; Technology: METAL GLAZE/THICK FILM; Termination: Wraparound; Reach SVHC Compliant: Yes; RoHS Compliant: Yes; ComponentLink1URL: https://datasheet.ciiva.com:443/pdfs/VipMasterIC/IC/YAGO/YAGO-S-A0008145938/YAGO-S-A0008145938-1.pdf?src-supplier=IHS+Markit; ComponentLink1Description: https://datasheet.ciiva.com:443/pdfs/VipMasterIC/IC/YAGO/YAGO-S-A0008145938/YAGO-S-A0008145938-1.pdf?src-supplier=IHS+Markit; LCSC Part Number: C105872
R3-R5 R8 R17 R18 R21-R23 R26 = RC0402JR-070RL: RES 0 OHM JUMPER 1/16W 0402; Manufacturer: Yageo; Power: 62.5mW; Rated Temperature: 70°C; Value: 0R; Package Height: 0.35mm; Package Length: 1mm; Package Width: 0.5mm; Supplier: Digikey; Supplier Part Number: 311-0.0JRCT-ND; Manufacturer Part Number: RC0402JR-070RL; RoHS: Yes; Category: Chip SMD Resistors; Stock: 5084390; Pricing: 1=0.1, 10=0.011, 25=0.0084, 50=0.0064, 100=0.0045, 250=0.00364, 500=0.0029, 1000=0.00214, 5000=0.00154 (USD); Mounting Technology: Surface Mount; Pins: 2; Package Shape: Rectangular; Case/Package: 0402; Terminal Finish: Nickel; Min Operating Temperature: -55°C; Max Operating Temperature: 155°C; JESD-609 Code: e3; Resistor Type: FIXED RESISTOR; Construction: Chip; Package Style: SMTMeter; Packaging: Tape and Reel; Technology: METAL GLAZE/THICK FILM; Termination: Wraparound; Reach SVHC Compliant: Yes; RoHS Compliant: Yes; ComponentLink1URL: https://datasheet.ciiva.com:443/pdfs/VipMasterIC/IC/YAGO/YAGO-S-A0008145938/YAGO-S-A0008145938-1.pdf?src-supplier=IHS+Markit; ComponentLink1Description: https://datasheet.ciiva.com:443/pdfs/VipMasterIC/IC/YAGO/YAGO-S-A0008145938/YAGO-S-A0008145938-1.pdf?src-supplier=IHS+Markit; LCSC Part Number: C60485
R6 R7 R14 R16 = RC0402FR-0727RL: 27 OHM 1% 1/16W 0402; Manufacturer: Yageo; Power Rating: 62.5mW; Voltage Rating: 50V; Temperature Coefficient: 100ppm/°C; Max Power Dissipation: 63mW; Supplier: Digikey; Supplier Part Number: YAG3086CT-ND; Manufacturer Part Number: RC0402FR-0727RL; RoHS: Yes; Category: Chip SMD Resistors; Stock: 268173; Pricing: 1=0.1, 10=0.015, 50=0.0088, 100=0.0073, 500=0.00488, 1000=0.00417, 5000=0.00297 (USD); Case/Package: 0402; Case Code (Imperial): 0402; Case Code (Metric): 1005; Weight: 2.3E-05oz; Min Operating Temperature: -55°C; Max Operating Temperature: 155°C; Value: 27R; Tolerance: 1%; Packaging: Tape and Reel; Resistor Type: Thick Film; Termination: SMD/SMT; Number of Terminations: 2; Features: Moisture Resistant; Series: RC; Construction: Rectangular; Technology: THICK FILM; Resistance Tolerance: 1%; Voltage Rating (AC): 50V; Length: 1mm; Width: 0.5mm; Height: 0.016inch; Depth: 0.5mm; Military Standard: Not; Lead Free: Lead Free; RoHS Compliant: Yes; Reach SVHC Compliant: Unknown; ComponentLink1URL: https://datasheet.ciiva.com/11808/0900766b80c66297-11808450.pdf?src-supplier=Rs; ComponentLink1Description: https://datasheet.ciiva.com/11808/0900766b80c66297-11808450.pdf?src-supplier=Rs; ComponentLink2URL: https://datasheet.ciiva.com/17044/pyu-rc0402-51-rohs-l-6-17044345.pdf?src-supplier=Future+Electronics; ComponentLink2Description: https://datasheet.ciiva.com/17044/pyu-rc0402-51-rohs-l-6-17044345.pdf?src-supplier=Future+Electronics; ComponentLink3URL: https://datasheet.ciiva.com/7849/1018594-7849927.pdf?src-supplier=Element14; ComponentLink3Description: https://datasheet.ciiva.com/7849/1018594-7849927.pdf?src-supplier=Element14; ComponentLink4URL: https://datasheet.ciiva.com/7849/1018594-7849926.pdf?src-supplier=Element14; ComponentLink4Description: https://datasheet.ciiva.com/7849/1018594-7849926.pdf?src-supplier=Element14; LCSC Part Number: C138021
R9 R13 R15 R19 R20 = AC0402FR-0710KL: 10 kOhm, ± 1%, 62.5 mW, 0402 [1005 Metric], SMD Chip Resistor, Thick Film, General Purpose; Manufacturer: Yageo; Value: 10kR; Power Rating: 62.5mW; Voltage Rating: 50V; Temperature Coefficient: 100ppm/°C; Max Power Dissipation: 63mW; Supplier: Digikey; Supplier Part Number: YAG3436CT-ND; Manufacturer Part Number: AC0402FR-0710KL; RoHS: Yes; Category: Chip SMD Resistors; Stock: 2394753; Pricing: 1=0.1, 10=0.019, 50=0.0116, 100=0.0095, 500=0.00638, 1000=0.00544, 5000=0.00391 (USD); Case/Package: 0402; Case Code (Imperial): 0402; Case Code (Metric): 1005; Min Operating Temperature: -55°C; Max Operating Temperature: 155°C; Tolerance: 1%; Packaging: Tape and Reel; Termination: SMD/SMT; Number of Terminations: 2; Features: Moisture Resistant,Automotive AEC-Q200; Series: AC; Length: 0.039inch; Width: 0.02inch; Height: 0.015inch; Lead Free: Lead Free; RoHS Compliant: Yes; ComponentLink1URL: https://datasheet.ciiva.com/12656/pyu-ac-51-rohs-l-2-12656634.pdf?src-supplier=Mouser; ComponentLink1Description: https://datasheet.ciiva.com/12656/pyu-ac-51-rohs-l-2-12656634.pdf?src-supplier=Mouser; LCSC Part Number: C144807
R12 = RC0402FR-074K7L: RES 4.7K OHM 1% 1/16W 0402; Manufacturer: Yageo; Additional Feature: LASER TRIMMABLE; Power: 62.5mW; Rated Temperature: 70°C; Value: 4.7kR; Temperature Coefficient: 100ppm/°C; Working Voltage: 50V; Package Height: 0.35mm; Package Length: 1mm; Package Width: 0.5mm; Supplier: Mouser; Supplier Part Number: 603-RC0402FR-074K7L; Manufacturer Part Number: RC0402FR-074K7L; RoHS: Yes; Category: Chip SMD Resistors; Stock: 1678412; Pricing: 1=0.1, 10=0.009, 50=0.009, 100=0.005, 1000=0.005, 10000=0.002 (USD); Mounting Technology: Surface Mount; Pins: 2; Package Shape: Rectangular; Case/Package: 0402; Terminal Finish: Nickel; Min Operating Temperature: -55°C; Max Operating Temperature: 155°C; Tolerance: 1%; JESD-609 Code: e3; Resistor Type: FIXED RESISTOR; Construction: Chip; Package Style: SMTMeter; Packaging: Tape and Reel; Technology: METAL GLAZE/THICK FILM; Termination: Wraparound; Reach SVHC Compliant: Yes; RoHS Compliant: Yes; ComponentLink1URL: https://datasheet.ciiva.com:443/pdfs/VipMasterIC/IC/YAGO/YAGO-S-A0008145938/YAGO-S-A0008145938-1.pdf?src-supplier=IHS+Markit; ComponentLink1Description: https://datasheet.ciiva.com:443/pdfs/VipMasterIC/IC/YAGO/YAGO-S-A0008145938/YAGO-S-A0008145938-1.pdf?src-supplier=IHS+Markit; ComponentLink2URL: https://datasheet.ciiva.com/22661/1686128-22661342.pdf?src-supplier=Element14; ComponentLink2Description: https://datasheet.ciiva.com/22661/1686128-22661342.pdf?src-supplier=Element14; ComponentLink3URL: https://datasheet.ciiva.com/7850/1018594-7850022.pdf?src-supplier=Element14; ComponentLink3Description: https://datasheet.ciiva.com/7850/1018594-7850022.pdf?src-supplier=Element14; ComponentLink4URL: https://datasheet.ciiva.com/7850/1018594-7850023.pdf?src-supplier=Element14; ComponentLink4Description: https://datasheet.ciiva.com/7850/1018594-7850023.pdf?src-supplier=Element14; ComponentLink5URL: https://datasheet.ciiva.com/15215/getdatasheetpartid-328119-15215035.pdf?src-supplier=Verical; ComponentLink5Description: https://datasheet.ciiva.com/15215/getdatasheetpartid-328119-15215035.pdf?src-supplier=Verical; LCSC Part Number: C105871
R24 R25 = RC0402FR-071KL: RES 1K OHM 1% 1/16W 0402; Manufacturer: Yageo; Value: 1kR; Temperature Coefficient: 100ppm/°C; Power Rating: 62.5mW; Voltage Rating: 50V; Max Power Dissipation: 63mW; Supplier: Digikey; Supplier Part Number: 311-1.00KLRCT-ND; Manufacturer Part Number: RC0402FR-071KL; RoHS: Yes; Category: Chip SMD Resistors; Stock: 8231639; Pricing: 1=0.1, 10=0.015, 50=0.0088, 100=0.0073, 500=0.00488, 1000=0.00417, 5000=0.00297 (USD); Case/Package: 0402; Pins: 2; Case Code (Imperial): 0402; Case Code (Metric): 1005; Min Operating Temperature: -55°C; Max Operating Temperature: 155°C; Tolerance: 1%; Packaging: Tape and Reel; Resistor Type: Thick Film; Voltage Rating (DC): 50V; Termination: SMD/SMT; Features: Moisture Resistant; Series: RC; Number of Terminations: 2; Resistance Tolerance: 1%; Construction: Rectangular; Technology: THICK FILM; Voltage Rating (AC): 50V; Length: 1mm; Width: 0.5mm; Height: 0.32mm; Depth: 0.5mm; Reach SVHC Compliant: No; Lead Free: 5697LeadFree; Military Standard: Not; RoHS Compliant: Yes; ComponentLink1URL: https://datasheet.ciiva.com/11819/0900766b80c66297-11819477.pdf?src-supplier=Rs; ComponentLink1Description: https://datasheet.ciiva.com/11819/0900766b80c66297-11819477.pdf?src-supplier=Rs; ComponentLink2URL: https://datasheet.ciiva.com/7983/1018594-7983502.pdf?src-supplier=Element14; ComponentLink2Description: https://datasheet.ciiva.com/7983/1018594-7983502.pdf?src-supplier=Element14; ComponentLink3URL: https://datasheet.ciiva.com/22747/1018594-22747513.pdf?src-supplier=Element14; ComponentLink3Description: https://datasheet.ciiva.com/22747/1018594-22747513.pdf?src-supplier=Element14; ComponentLink4URL: https://datasheet.ciiva.com/12666/pyu-rc0402-51-rohs-l-6-r-12666741.pdf?src-supplier=Mouser; ComponentLink4Description: https://datasheet.ciiva.com/12666/pyu-rc0402-51-rohs-l-6-r-12666741.pdf?src-supplier=Mouser; ComponentLink5URL: https://datasheet.ciiva.com/7849/1018594-7849869.pdf?src-supplier=Element14; ComponentLink5Description: https://datasheet.ciiva.com/7849/1018594-7849869.pdf?src-supplier=Element14; ComponentLink6URL: https://datasheet.ciiva.com/7849/1018594-7849871.pdf?src-supplier=Element14; ComponentLink6Description: https://datasheet.ciiva.com/7849/1018594-7849871.pdf?src-supplier=Element14; ComponentLink7URL: https://datasheet.ciiva.com/17063/pyu-rc0402-51-rohs-l-6-r-17063193.pdf?src-supplier=Future+Electronics; ComponentLink7Description: https://datasheet.ciiva.com/17063/pyu-rc0402-51-rohs-l-6-r-17063193.pdf?src-supplier=Future+Electronics; LCSC Part Number: C106235
SW1 SW2 = PTS645SM43SMTR92LFS: SWITCH TACTILE SPST-NO 0.05A 12V; Manufacturer: ITT C&K; Actuator Type: Pushbutton; Contact Current(DC)-Max: 50mA; Contact DC Max Rating R Load: 0.05A@12VDC; Contact Resistance: 0.1mR; Dielectric Withstand Volts: 250VACV; Electrical Life: 100000Cycles; Insulation Resistance: 100GR; PCB Hole Count: 4; Switch Action: MOMENTARY; Switch Function: SPST; Switch Type: Keypad; Body Breadth: 5.9944inch; Body Height: 3.4544mm; Body Length or Diameter: 5.9944mm; Supplier: Digikey; Supplier Part Number: CKN9112CT-ND; Manufacturer Part Number: PTS645SM43SMTR92LFS; RoHS: Yes; Category: Tactile Switches; Stock: 311585; Pricing: 1=0.32, 10=0.308, 25=0.2916, 100=0.2641, 250=0.24072, 500=0.22376 (USD); Mounting Technology: Surface Mount; Terminal Finish: Silver; Min Operating Temperature: -20°C; Max Operating Temperature: 60°C; JESD-609 Code: e4; Contact Voltage(DC)-Max: 12V; Termination: Solder; Terminal Length: 0.138inch; Reach SVHC Compliant: Yes; RoHS Compliant: Yes; ComponentLink1URL: https://datasheet.ciiva.com:443/pdfs/VipMasterIC/IC/CKCI/CKCI-S-A0001796527/CKCI-S-A0001796842-1.pdf?src-supplier=IHS+Markit; ComponentLink1Description: https://datasheet.ciiva.com:443/pdfs/VipMasterIC/IC/CKCI/CKCI-S-A0001796527/CKCI-S-A0001796842-1.pdf?src-supplier=IHS+Markit; ComponentLink2URL: https://datasheet.ciiva.com/29903/getdatasheetpartid-786341-29903846.pdf?src-supplier=Verical; ComponentLink2Description: https://datasheet.ciiva.com/29903/getdatasheetpartid-786341-29903846.pdf?src-supplier=Verical; ComponentLink3URL: https://datasheet.ciiva.com/14920/pts645-14920735.pdf?src-supplier=Digikey; ComponentLink3Description: https://datasheet.ciiva.com/14920/pts645-14920735.pdf?src-supplier=Digikey; ComponentLink4URL: https://datasheet.ciiva.com/14920/pts645-14920734.pdf?src-supplier=Digikey; ComponentLink4Description: https://datasheet.ciiva.com/14920/pts645-14920734.pdf?src-supplier=Digikey; LCSC Part Number: C221880
U1 = ESP32-S3-MINI-1-N8: ESP32-S3FN8, 8 MB SPI flash, PCB antenna; Manufacturer: Espressif Systems; Supplier: Digikey; Supplier Part Number: 1965-ESP32-S3-MINI-1-N8CT-ND; Manufacturer Part Number: ESP32-S3-MINI-1-N8; RoHS: No; Category: LDO; Stock: 19254; Pricing: 1=3.1 (USD); ComponentLink1URL: https://datasheet.octopart.com/ESP32-S3-MINI-1-N8-Espressif-Systems-datasheet-165560562.pdf?src-supplier=TME; ComponentLink1Description: https://datasheet.octopart.com/ESP32-S3-MINI-1-N8-Espressif-Systems-datasheet-165560562.pdf?src-supplier=TME; LCSC Part Number: C2913206
U2 = TL1963A-33DCYR: IC REG LINEAR 3.3V 1.5A SOT223-4; Manufacturer: Texas Instruments; Package Body Material: Plastic; Adjustability: FIXED; Dropout Voltage1-Max: 550mV; Dropout Voltage1-Nom: 340mV; Input Voltage Absolute-Max: 20V; Min Input Voltage: 3.8V; Line Regulation-Max: 0.01%; Load Regulation-Max: 0.07%; Channels: 1; Output Voltage1-Max: 3.4V; Output Voltage1-Min: 3.2V; Regulator Type: FIXED POSITIVE SINGLE OUTPUT LDO REGULATOR; Voltage Tolerance-Max: 3%; Qualification Status: Not Qualified; Supplier: Digikey; Supplier Part Number: 296-24897-1-ND; Manufacturer Part Number: TL1963A-33DCYR; RoHS: Yes; Category: Voltage Regulators - Linear; Stock: 2958; Pricing: 1=2.87, 10=2.578, 25=2.4368, 100=2.112, 250=2.00368, 500=1.79788, 1000=1.51629 (USD); Case/Package: SOP; Pins: 4; Package Shape: Rectangular; Terminal Finish: Tin; JESD-609 Code: e3; Max Supply Voltage: 20V; JESD-30 Code: R-PDSO-G4; Moisture Sensitivity Level: 2; Number of Outputs: 1; Operating Temperature, TJ-Max: 125°C; Operating Temperature, TJ-Min: -40°C; Output Current1-Max: 1.5A; Output Voltage1-Nom: 3.3V; Package Style: SMALL OUTLINEMeter; Packaging: Tape and Reel; Peak Reflow Temperature (Cel): 260°C; Surface Mount: Yes; Technology: BIPOLAR; Terminal Form: Gull Wing; Terminal Position: DUAL; Length: 6.5mm; Width: 3.5mm; Height - Seated (Max): 1.8mm; Terminal Pitch: 2.3mm; Reach SVHC Compliant: Yes; RoHS Compliant: Yes; ComponentLink1URL: https://www.ti.com:443/lit/ds/symlink/tl1963a.pdf?src-supplier=IHS+Markit; ComponentLink1Description: https://www.ti.com:443/lit/ds/symlink/tl1963a.pdf?src-supplier=IHS+Markit; ComponentLink2URL: https://datasheet.ciiva.com/2046/-2046068.pdf?src-supplier=Digikey; ComponentLink2Description: https://datasheet.ciiva.com/2046/-2046068.pdf?src-supplier=Digikey; LCSC Part Number: C181262
U3 = FT231XQ-R: IC USB SERIAL FULL UART 20QFN; Manufacturer: FTDI; Power Supplies: 3.3/5V; Max Supply Current: 8.4mA; Max Supply Voltage: 5.5V; Min Supply Voltage: 2.97V; Nominal Supply Voltage: 5V; Qualification Status: Not Qualified; Supplier: Digikey; Supplier Part Number: 768-1128-1-ND; Manufacturer Part Number: FT231XQ-R; RoHS: Yes; Category: Interface ICs; Stock: 67762; Pricing: 1=2.34, 25=2.27, 100=2.2, 250=2, 500=1.82002, 1000=1.7625 (USD); Case/Package: HVQCCN; Pins: 20; Package Shape: Square; Min Operating Temperature: -40°C; Max Operating Temperature: 85°C; JESD-30 Code: S-XQCC-N20; Package Style: CHIP CARRIER, HEAT SINK/SLUG, VERY THIN PROFILEMeter; Surface Mount: Yes; Technology: CMOS; Terminal Form: No Lead; Terminal Position: QUAD; Length: 4mm; Width: 4mm; Height - Seated (Max): 0.8mm; Terminal Pitch: 0.5mm; Temperature Grade: INDUSTRIAL; Reach SVHC Compliant: Yes; RoHS Compliant: Yes; ComponentLink1URL: https://datasheet.ciiva.com:443/pdfs/VipMasterIC/IC/FTDI/FTDIS00099/FTDIS00099-1.pdf?src-supplier=IHS+Markit; ComponentLink1Description: https://datasheet.ciiva.com:443/pdfs/VipMasterIC/IC/FTDI/FTDIS00099/FTDIS00099-1.pdf?src-supplier=IHS+Markit; ComponentLink2URL: https://datasheet.ciiva.com/1787/ds-ft231x-1787312.pdf?src-supplier=Digikey; ComponentLink2Description: https://datasheet.ciiva.com/1787/ds-ft231x-1787312.pdf?src-supplier=Digikey; ComponentLink3URL: https://datasheet.ciiva.com/4787/ds-ft231x-13571-4787570.pdf?src-supplier=Mouser; ComponentLink3Description: https://datasheet.ciiva.com/4787/ds-ft231x-13571-4787570.pdf?src-supplier=Mouser; ComponentLink4URL: https://datasheet.ciiva.com/30475/0900766b811020d3-30475405.pdf?src-supplier=Rs; ComponentLink4Description: https://datasheet.ciiva.com/30475/0900766b811020d3-30475405.pdf?src-supplier=Rs; ComponentLink5URL: https://datasheet.ciiva.com/1787/ft-x-series-1787313.pdf?src-supplier=Digikey; ComponentLink5Description: https://datasheet.ciiva.com/1787/ft-x-series-1787313.pdf?src-supplier=Digikey; ComponentLink6URL: https://datasheet.ciiva.com/1787/ft-x-series-1787314.pdf?src-supplier=Digikey; ComponentLink6Description: https://datasheet.ciiva.com/1787/ft-x-series-1787314.pdf?src-supplier=Digikey; LCSC Part Number: C132159